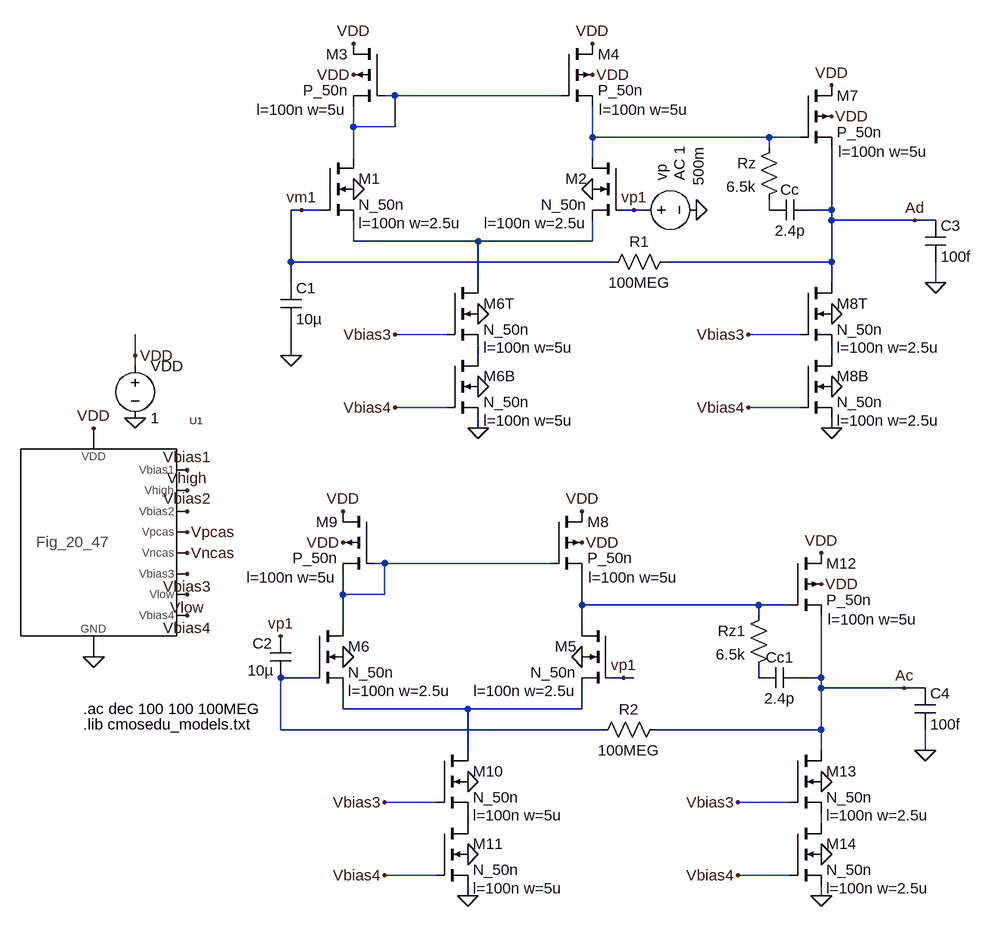
[diagram p0: schematic Fig24_25_CMRR.asc]
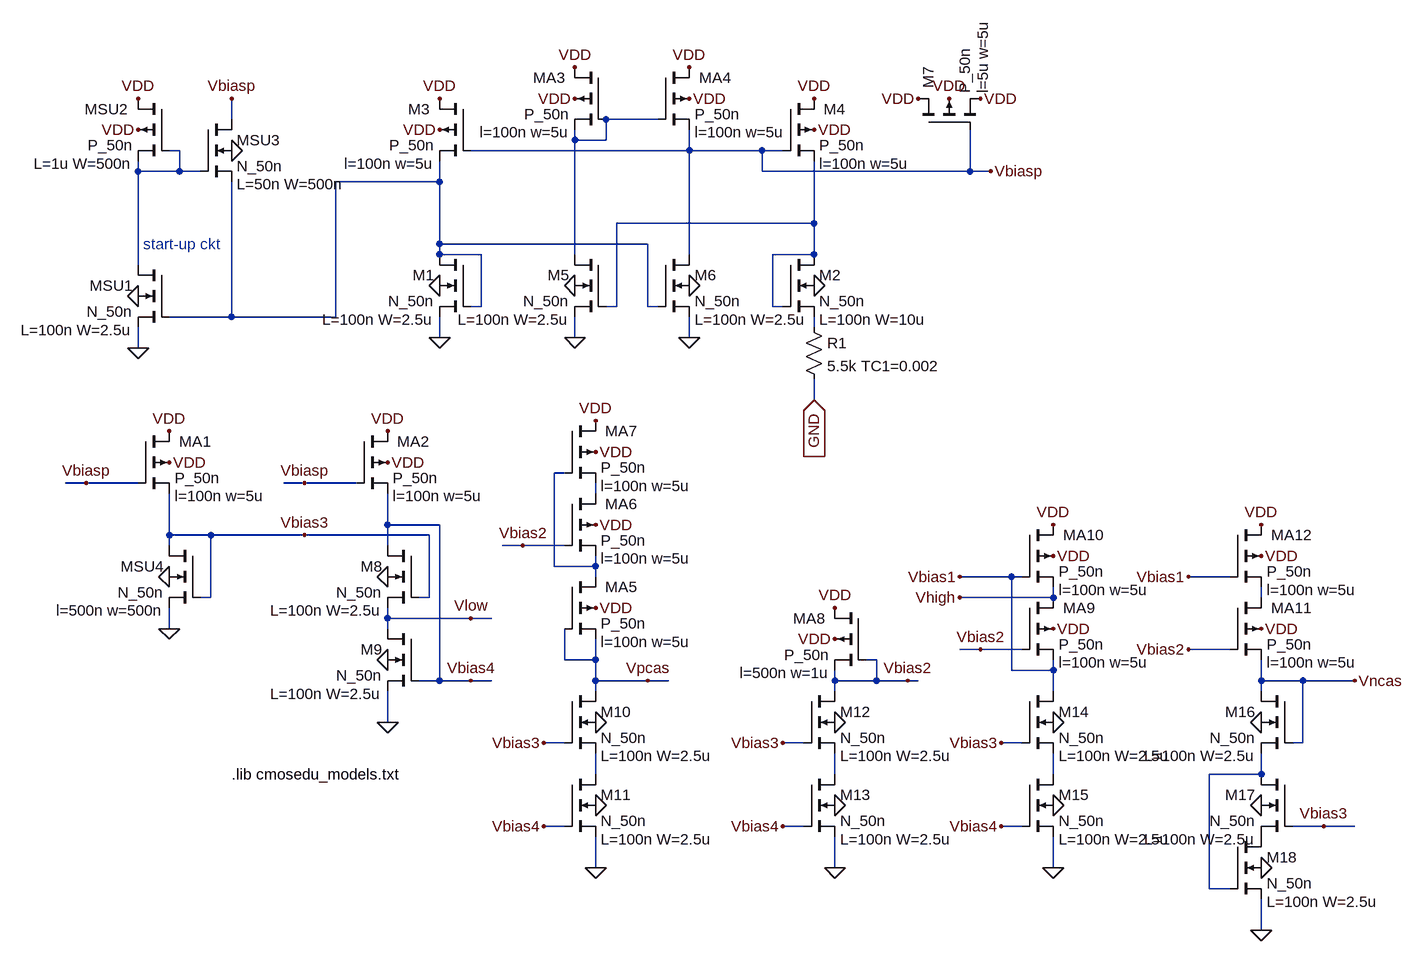
[diagram p1: sub-circuit fig_20_47.asc]
Fig24_25_CMRR.asc, the LTspice schematic file:
Version 4
SHEET 1 2160 680
WIRE 1264 -752 1248 -752
WIRE 1520 -752 1264 -752
WIRE 1200 -704 1200 -736
WIRE 1264 -704 1264 -752
WIRE 1264 -704 1200 -704
WIRE 1568 -688 1568 -736
WIRE 1840 -688 1568 -688
WIRE 1888 -688 1840 -688
WIRE 1840 -672 1840 -688
WIRE 1200 -656 1200 -704
WIRE 1568 -656 1568 -688
WIRE 1120 -576 1104 -576
WIRE 1152 -576 1120 -576
WIRE 1632 -576 1616 -576
WIRE 1648 -576 1632 -576
WIRE 1840 -576 1840 -592
WIRE 1936 -576 1936 -672
WIRE 1936 -576 1904 -576
WIRE 1936 -560 1936 -576
WIRE 2064 -560 1936 -560
WIRE 2096 -560 2064 -560
WIRE 1200 -528 1200 -560
WIRE 1392 -528 1200 -528
WIRE 1568 -528 1568 -560
WIRE 1568 -528 1392 -528
WIRE 1104 -496 1104 -576
WIRE 1600 -496 1104 -496
WIRE 1936 -496 1936 -560
WIRE 1936 -496 1680 -496
WIRE 1104 -464 1104 -496
WIRE 1392 -464 1392 -528
WIRE 1936 -464 1936 -496
WIRE 2096 -464 2096 -496
WIRE 1344 -384 1264 -384
WIRE 1888 -384 1808 -384
WIRE 864 -352 864 -384
WIRE 1104 -352 1104 -400
WIRE 1392 -352 1392 -368
WIRE 1936 -352 1936 -368
WIRE 864 -336 864 -352
WIRE 1344 -272 1264 -272
WIRE 1888 -272 1808 -272
WIRE 1392 -240 1392 -256
WIRE 1936 -240 1936 -256
WIRE 1248 -32 1232 -32
WIRE 1504 -32 1248 -32
WIRE 1184 16 1184 -16
WIRE 1248 16 1248 -32
WIRE 1248 16 1184 16
WIRE 1552 32 1552 -16
WIRE 1824 32 1552 32
WIRE 1872 32 1824 32
WIRE 1824 48 1824 32
WIRE 1184 64 1184 16
WIRE 1552 64 1552 32
WIRE 1136 144 1088 144
WIRE 1616 144 1600 144
WIRE 1632 144 1616 144
WIRE 1824 144 1824 128
WIRE 1920 144 1920 48
WIRE 1920 144 1888 144
WIRE 1920 160 1920 144
WIRE 2048 160 1920 160
WIRE 2080 160 2048 160
WIRE 1184 192 1184 160
WIRE 1376 192 1184 192
WIRE 1552 192 1552 160
WIRE 1552 192 1376 192
WIRE 1088 224 1088 144
WIRE 1584 224 1088 224
WIRE 1920 224 1920 160
WIRE 1920 224 1664 224
WIRE 1376 256 1376 192
WIRE 1920 256 1920 224
WIRE 2080 256 2080 224
WIRE 1328 336 1248 336
WIRE 1872 336 1792 336
WIRE 1376 368 1376 352
WIRE 1920 368 1920 352
WIRE 1328 448 1248 448
WIRE 1872 448 1792 448
WIRE 1376 480 1376 464
WIRE 1920 480 1920 464
FLAG 864 -256 0
FLAG 864 -352 VDD
FLAG 1568 -608 0
FLAG 1392 -240 0
FLAG 1200 -608 0
FLAG 1568 -832 VDD
FLAG 1568 -784 VDD
FLAG 1200 -784 VDD
FLAG 800 -240 VDD
FLAG 800 112 0
FLAG 944 -176 Vbias1
FLAG 944 -144 Vhigh
FLAG 944 -112 Vbias2
FLAG 944 -16 Vbias3
FLAG 944 -80 Vpcas
FLAG 944 -48 Vncas
FLAG 944 48 Vbias4
FLAG 944 16 Vlow
FLAG 1200 -832 VDD
FLAG 1392 -416 0
FLAG 1392 -304 0
FLAG 1264 -384 Vbias3
FLAG 1264 -272 Vbias4
FLAG 1728 -576 0
FLAG 1120 -576 vm1
FLAG 1632 -576 vp1
FLAG 1936 -768 VDD
FLAG 1936 -720 VDD
FLAG 1936 -240 0
FLAG 1936 -416 0
FLAG 1936 -304 0
FLAG 1808 -384 Vbias3
FLAG 1808 -272 Vbias4
FLAG 2064 -560 Ad
FLAG 1104 -352 0
FLAG 2096 -464 0
FLAG 1552 112 0
FLAG 1376 480 0
FLAG 1184 112 0
FLAG 1552 -112 VDD
FLAG 1552 -64 VDD
FLAG 1184 -64 VDD
FLAG 1184 -112 VDD
FLAG 1376 304 0
FLAG 1376 416 0
FLAG 1248 336 Vbias3
FLAG 1248 448 Vbias4
FLAG 1616 144 vp1
FLAG 1920 -48 VDD
FLAG 1920 0 VDD
FLAG 1920 480 0
FLAG 1920 304 0
FLAG 1920 416 0
FLAG 1792 336 Vbias3
FLAG 1792 448 Vbias4
FLAG 2048 160 Ac
FLAG 2080 256 0
FLAG 1088 80 vp1
SYMBOL voltage 864 -352 R0
WINDOW 123 0 0 Left 0
WINDOW 39 0 0 Left 0
SYMATTR InstName VDD
SYMATTR Value 1
SYMBOL nmos4 1616 -656 M0
WINDOW 123 56 100 Left 0
SYMATTR Value2 l=100n w=2.5u
SYMATTR InstName M2
SYMATTR Value N_50n
SYMBOL nmos4 1152 -656 R0
WINDOW 123 56 100 Left 0
SYMATTR Value2 l=100n w=2.5u
SYMATTR InstName M1
SYMATTR Value N_50n
SYMBOL pmos4 1520 -832 R0
WINDOW 123 58 102 Left 0
WINDOW 0 56 16 Left 0
SYMATTR Value2 l=100n w=5u
SYMATTR InstName M4
SYMATTR Value P_50n
SYMBOL pmos4 1248 -832 M0
WINDOW 123 58 102 Left 0
WINDOW 0 56 16 Left 0
SYMATTR Value2 l=100n w=5u
SYMATTR InstName M3
SYMATTR Value P_50n
SYMBOL Fig_20_47 800 -64 R0
SYMATTR InstName U1
SYMBOL nmos4 1344 -464 R0
WINDOW 123 56 100 Left 0
SYMATTR Value2 l=100n w=5u
SYMATTR InstName M6T
SYMATTR Value N_50n
SYMBOL nmos4 1344 -352 R0
WINDOW 123 56 100 Left 0
SYMATTR Value2 l=100n w=5u
SYMATTR InstName M6B
SYMATTR Value N_50n
SYMBOL voltage 1632 -576 R270
WINDOW 0 45 42 Left 0
WINDOW 3 37 99 Left 0
WINDOW 123 45 70 Left 0
WINDOW 39 0 0 Left 0
SYMATTR InstName vp
SYMATTR Value 500m
SYMATTR Value2 AC 1
SYMBOL pmos4 1888 -768 R0
WINDOW 123 58 102 Left 0
WINDOW 0 56 16 Left 0
SYMATTR Value2 l=100n w=5u
SYMATTR InstName M7
SYMATTR Value P_50n
SYMBOL nmos4 1888 -464 R0
WINDOW 123 56 100 Left 0
SYMATTR Value2 l=100n w=2.5u
SYMATTR InstName M8T
SYMATTR Value N_50n
SYMBOL nmos4 1888 -352 R0
WINDOW 123 56 100 Left 0
SYMATTR Value2 l=100n w=2.5u
SYMATTR InstName M8B
SYMATTR Value N_50n
SYMBOL cap 1088 -464 R0
SYMATTR InstName C1
SYMATTR Value 10µ
SYMBOL res 1584 -480 R270
WINDOW 0 32 56 VTop 0
WINDOW 3 0 56 VBottom 0
SYMATTR InstName R1
SYMATTR Value 100MEG
SYMBOL cap 1904 -592 R90
WINDOW 0 0 32 VBottom 0
WINDOW 3 32 32 VTop 0
SYMATTR InstName Cc
SYMATTR Value 2.4p
SYMBOL cap 2080 -560 R0
SYMATTR InstName C3
SYMATTR Value 100f
SYMBOL res 1856 -688 M0
SYMATTR InstName Rz
SYMATTR Value 6.5k
SYMBOL nmos4 1600 64 M0
WINDOW 123 56 100 Left 0
SYMATTR Value2 l=100n w=2.5u
SYMATTR InstName M5
SYMATTR Value N_50n
SYMBOL nmos4 1136 64 R0
WINDOW 123 56 100 Left 0
SYMATTR Value2 l=100n w=2.5u
SYMATTR InstName M6
SYMATTR Value N_50n
SYMBOL pmos4 1504 -112 R0
WINDOW 123 58 102 Left 0
WINDOW 0 56 16 Left 0
SYMATTR Value2 l=100n w=5u
SYMATTR InstName M8
SYMATTR Value P_50n
SYMBOL pmos4 1232 -112 M0
WINDOW 123 58 102 Left 0
WINDOW 0 56 16 Left 0
SYMATTR Value2 l=100n w=5u
SYMATTR InstName M9
SYMATTR Value P_50n
SYMBOL nmos4 1328 256 R0
WINDOW 123 56 100 Left 0
SYMATTR Value2 l=100n w=5u
SYMATTR InstName M10
SYMATTR Value N_50n
SYMBOL nmos4 1328 368 R0
WINDOW 123 56 100 Left 0
SYMATTR Value2 l=100n w=5u
SYMATTR InstName M11
SYMATTR Value N_50n
SYMBOL pmos4 1872 -48 R0
WINDOW 123 58 102 Left 0
WINDOW 0 56 16 Left 0
SYMATTR Value2 l=100n w=5u
SYMATTR InstName M12
SYMATTR Value P_50n
SYMBOL nmos4 1872 256 R0
WINDOW 123 56 100 Left 0
SYMATTR Value2 l=100n w=2.5u
SYMATTR InstName M13
SYMATTR Value N_50n
SYMBOL nmos4 1872 368 R0
WINDOW 123 56 100 Left 0
SYMATTR Value2 l=100n w=2.5u
SYMATTR InstName M14
SYMATTR Value N_50n
SYMBOL res 1568 240 R270
WINDOW 0 32 56 VTop 0
WINDOW 3 0 56 VBottom 0
SYMATTR InstName R2
SYMATTR Value 100MEG
SYMBOL cap 1888 128 R90
WINDOW 0 0 32 VBottom 0
WINDOW 3 32 32 VTop 0
SYMATTR InstName Cc1
SYMATTR Value 2.4p
SYMBOL cap 2064 160 R0
SYMATTR InstName C4
SYMATTR Value 100f
SYMBOL res 1840 32 M0
SYMATTR InstName Rz1
SYMATTR Value 6.5k
SYMBOL cap 1072 80 R0
WINDOW 0 -27 11 Left 0
WINDOW 3 -35 53 Left 0
SYMATTR InstName C2
SYMATTR Value 10µ
TEXT 784 216 Left 0 !.lib cmosedu_models.txt
TEXT 784 192 Left 0 !.ac dec 100 100 100MEG

fig_20_47.asc, the sub-circuit schematic file:
Version 4
SHEET 1 2508 1124
WIRE 464 416 432 416
WIRE 544 -64 544 -80
WIRE 544 80 544 -64
WIRE 544 208 544 176
WIRE 544 416 464 416
WIRE 592 496 592 432
WIRE 592 512 592 496
WIRE 592 640 592 608
WIRE 608 -96 592 -96
WIRE 608 -64 544 -64
WIRE 608 -64 608 -96
WIRE 640 -64 608 -64
WIRE 656 496 592 496
WIRE 656 592 640 592
WIRE 656 592 656 496
WIRE 688 -144 688 -176
WIRE 688 160 592 160
WIRE 688 160 688 -48
WIRE 800 416 768 416
WIRE 800 496 656 496
WIRE 848 160 688 160
WIRE 848 160 848 -48
WIRE 880 416 800 416
WIRE 928 480 928 432
WIRE 928 512 928 480
WIRE 928 624 928 608
WIRE 928 640 928 624
WIRE 928 784 928 736
WIRE 992 496 800 496
WIRE 992 592 976 592
WIRE 992 592 992 496
WIRE 1008 -48 848 -48
WIRE 1008 -48 1008 -80
WIRE 1008 48 1008 -48
WIRE 1008 64 1008 48
WIRE 1008 192 1008 160
WIRE 1008 480 928 480
WIRE 1008 720 976 720
WIRE 1008 720 1008 480
WIRE 1056 624 928 624
WIRE 1056 720 1008 720
WIRE 1072 64 1008 64
WIRE 1072 144 1056 144
WIRE 1072 144 1072 64
WIRE 1088 624 1056 624
WIRE 1088 720 1056 720
WIRE 1136 512 1104 512
WIRE 1184 544 1184 400
WIRE 1200 400 1184 400
WIRE 1200 512 1136 512
WIRE 1200 688 1200 640
WIRE 1200 816 1168 816
WIRE 1200 944 1168 944
WIRE 1216 -112 1216 -128
WIRE 1216 64 1216 -112
WIRE 1216 192 1216 160
WIRE 1248 432 1248 416
WIRE 1248 544 1184 544
WIRE 1248 544 1248 528
WIRE 1248 560 1248 544
WIRE 1248 688 1200 688
WIRE 1248 688 1248 656
WIRE 1248 720 1248 688
WIRE 1248 736 1248 720
WIRE 1248 864 1248 832
WIRE 1248 1008 1248 960
WIRE 1264 -112 1216 -112
WIRE 1264 -112 1264 -144
WIRE 1280 144 1264 144
WIRE 1280 144 1280 16
WIRE 1328 48 1008 48
WIRE 1328 144 1328 48
WIRE 1328 720 1248 720
WIRE 1344 -144 1264 -144
WIRE 1344 144 1328 144
WIRE 1360 720 1328 720
WIRE 1392 -96 1056 -96
WIRE 1392 -96 1392 -128
WIRE 1392 64 1392 -96
WIRE 1392 192 1392 160
WIRE 1504 -96 1392 -96
WIRE 1504 -64 1504 -96
WIRE 1520 144 1520 64
WIRE 1536 -96 1504 -96
WIRE 1536 144 1520 144
WIRE 1568 816 1536 816
WIRE 1568 944 1536 944
WIRE 1584 16 1280 16
WIRE 1584 16 1584 -80
WIRE 1584 64 1520 64
WIRE 1584 64 1584 16
WIRE 1584 176 1584 160
WIRE 1584 288 1584 256
WIRE 1616 720 1616 704
WIRE 1616 736 1616 720
WIRE 1616 864 1616 832
WIRE 1616 1008 1616 960
WIRE 1680 688 1664 688
WIRE 1680 720 1616 720
WIRE 1680 720 1680 688
WIRE 1728 720 1680 720
WIRE 1744 720 1728 720
WIRE 1824 -64 1504 -64
WIRE 1824 -64 1824 -128
WIRE 1840 672 1808 672
WIRE 1856 -64 1824 -64
WIRE 1888 560 1808 560
WIRE 1888 704 1888 560
WIRE 1904 560 1888 560
WIRE 1904 672 1840 672
WIRE 1904 816 1872 816
WIRE 1904 944 1872 944
WIRE 1952 592 1808 592
WIRE 1952 592 1952 576
WIRE 1952 704 1888 704
WIRE 1952 704 1952 688
WIRE 1952 736 1952 704
WIRE 1952 864 1952 832
WIRE 1952 1008 1952 960
WIRE 2192 1040 2192 864
WIRE 2224 560 2160 560
WIRE 2224 672 2160 672
WIRE 2224 1040 2192 1040
WIRE 2272 592 2272 576
WIRE 2272 720 2272 688
WIRE 2272 736 2272 720
WIRE 2272 864 2192 864
WIRE 2272 864 2272 832
WIRE 2272 880 2272 864
WIRE 2272 1104 2272 1056
WIRE 2336 720 2272 720
WIRE 2336 816 2320 816
WIRE 2336 816 2336 720
WIRE 2368 944 2320 944
WIRE 2416 720 2336 720
WIRE 2416 944 2368 944
FLAG 544 -128 VDD
FLAG 544 -176 VDD
FLAG 544 208 0
FLAG 544 128 0
FLAG 688 -96 0
FLAG 688 -176 Vbiasp
FLAG 1008 -128 VDD
FLAG 1008 -176 VDD
FLAG 1584 -128 VDD
FLAG 1584 -176 VDD
FLAG 1856 -64 Vbiasp
FLAG 1008 192 0
FLAG 1008 112 0
FLAG 1584 112 0
FLAG 1392 -176 VDD
FLAG 1392 -224 VDD
FLAG 1216 -176 VDD
FLAG 1216 -224 VDD
FLAG 1216 112 0
FLAG 1392 112 0
FLAG 1216 192 0
FLAG 1392 192 0
FLAG 1792 -176 VDD
FLAG 1744 -176 VDD
FLAG 1840 -176 VDD
FLAG 592 384 VDD
FLAG 592 336 VDD
FLAG 464 416 Vbiasp
FLAG 928 384 VDD
FLAG 928 336 VDD
FLAG 800 416 Vbiasp
FLAG 592 640 0
FLAG 592 560 0
FLAG 928 560 0
FLAG 928 688 0
FLAG 928 784 0
FLAG 800 496 Vbias3
FLAG 1248 784 0
FLAG 1248 912 0
FLAG 1248 1008 0
FLAG 1056 624 Vlow
FLAG 1056 720 Vbias4
FLAG 1168 816 Vbias3
FLAG 1168 944 Vbias4
FLAG 1616 784 0
FLAG 1616 912 0
FLAG 1616 1008 0
FLAG 1536 816 Vbias3
FLAG 1536 944 Vbias4
FLAG 1952 784 0
FLAG 1952 912 0
FLAG 1952 1008 0
FLAG 1872 816 Vbias3
FLAG 1872 944 Vbias4
FLAG 1248 608 VDD
FLAG 1328 720 Vpcas
FLAG 1248 480 VDD
FLAG 1248 368 VDD
FLAG 1248 320 VDD
FLAG 1136 512 Vbias2
FLAG 1616 656 VDD
FLAG 1616 608 VDD
FLAG 1728 720 Vbias2
FLAG 1952 640 VDD
FLAG 1952 528 VDD
FLAG 1952 480 VDD
FLAG 1840 672 Vbias2
FLAG 1808 560 Vbias1
FLAG 1808 592 Vhigh
FLAG 2272 640 VDD
FLAG 2272 528 VDD
FLAG 2272 480 VDD
FLAG 2160 560 Vbias1
FLAG 2160 672 Vbias2
FLAG 2272 784 0
FLAG 2272 912 0
FLAG 2272 1008 0
FLAG 2272 1104 0
FLAG 2416 720 Vncas
FLAG 2368 944 Vbias3
FLAG 1584 288 GND
IOPIN 1584 288 In
SYMBOL pmos4 592 -176 M0
WINDOW 0 63 16 Left 0
WINDOW 123 56 100 Left 0
SYMATTR InstName MSU2
SYMATTR Value2 L=1u W=500n
SYMATTR Value P_50n
SYMBOL nmos4 592 80 M0
WINDOW 123 56 100 Left 0
SYMATTR Value2 L=100n W=2.5u
SYMATTR InstName MSU1
SYMATTR Value N_50n
SYMBOL nmos4 640 -144 R0
WINDOW 123 56 100 Left 0
SYMATTR Value2 L=50n W=500n
SYMATTR InstName MSU3
SYMATTR Value N_50n
SYMBOL pmos4 1056 -176 M0
WINDOW 0 63 16 Left 0
WINDOW 123 56 100 Left 0
SYMATTR InstName M3
SYMATTR Value2 l=100n w=5u
SYMATTR Value P_50n
SYMBOL pmos4 1536 -176 R0
WINDOW 0 63 16 Left 0
WINDOW 123 56 100 Left 0
SYMATTR InstName M4
SYMATTR Value2 l=100n w=5u
SYMATTR Value P_50n
SYMBOL nmos4 1056 64 M0
WINDOW 123 56 100 Left 0
SYMATTR Value2 L=100n W=2.5u
SYMATTR InstName M1
SYMATTR Value N_50n
SYMBOL nmos4 1536 64 R0
WINDOW 123 56 100 Left 0
SYMATTR Value2 L=100n W=10u
SYMATTR InstName M2
SYMATTR Value N_50n
SYMBOL res 1568 160 R0
SYMATTR InstName R1
SYMATTR Value 5.5k TC1=0.002
SYMBOL pmos4 1344 -224 R0
WINDOW 0 63 16 Left 0
WINDOW 123 56 100 Left 0
SYMATTR InstName MA4
SYMATTR Value2 l=100n w=5u
SYMATTR Value P_50n
SYMBOL pmos4 1264 -224 M0
WINDOW 0 63 16 Left 0
WINDOW 123 56 100 Left 0
SYMATTR InstName MA3
SYMATTR Value2 l=100n w=5u
SYMATTR Value P_50n
SYMBOL nmos4 1264 64 M0
WINDOW 123 56 100 Left 0
SYMATTR Value2 L=100n W=2.5u
SYMATTR InstName M5
SYMATTR Value N_50n
SYMBOL nmos4 1344 64 R0
WINDOW 123 56 100 Left 0
SYMATTR Value2 L=100n W=2.5u
SYMATTR InstName M6
SYMATTR Value N_50n
SYMBOL pmos4 1744 -128 R270
WINDOW 0 63 16 Left 0
WINDOW 123 56 100 Left 0
SYMATTR InstName M7
SYMATTR Value2 l=5u w=5u
SYMATTR Value P_50n
SYMBOL pmos4 544 336 R0
WINDOW 0 63 16 Left 0
WINDOW 123 56 100 Left 0
SYMATTR InstName MA1
SYMATTR Value2 l=100n w=5u
SYMATTR Value P_50n
SYMBOL pmos4 880 336 R0
WINDOW 0 63 16 Left 0
WINDOW 123 56 100 Left 0
SYMATTR InstName MA2
SYMATTR Value2 l=100n w=5u
SYMATTR Value P_50n
SYMBOL nmos4 640 512 M0
WINDOW 123 56 100 Left 0
SYMATTR Value2 l=500n w=500n
SYMATTR InstName MSU4
SYMATTR Value N_50n
SYMBOL nmos4 976 512 M0
WINDOW 123 56 100 Left 0
SYMATTR Value2 L=100n W=2.5u
SYMATTR InstName M8
SYMATTR Value N_50n
SYMBOL nmos4 976 640 M0
WINDOW 123 56 100 Left 0
SYMATTR Value2 L=100n W=2.5u
SYMATTR InstName M9
SYMATTR Value N_50n
SYMBOL nmos4 1200 736 R0
WINDOW 123 56 100 Left 0
SYMATTR Value2 L=100n W=2.5u
SYMATTR InstName M10
SYMATTR Value N_50n
SYMBOL nmos4 1200 864 R0
WINDOW 123 56 100 Left 0
SYMATTR Value2 L=100n W=2.5u
SYMATTR InstName M11
SYMATTR Value N_50n
SYMBOL nmos4 1568 736 R0
WINDOW 123 56 100 Left 0
SYMATTR Value2 L=100n W=2.5u
SYMATTR InstName M12
SYMATTR Value N_50n
SYMBOL nmos4 1568 864 R0
WINDOW 123 56 100 Left 0
SYMATTR Value2 L=100n W=2.5u
SYMATTR InstName M13
SYMATTR Value N_50n
SYMBOL nmos4 1904 736 R0
WINDOW 123 56 100 Left 0
SYMATTR Value2 L=100n W=2.5u
SYMATTR InstName M14
SYMATTR Value N_50n
SYMBOL nmos4 1904 864 R0
WINDOW 123 56 100 Left 0
SYMATTR Value2 L=100n W=2.5u
SYMATTR InstName M15
SYMATTR Value N_50n
SYMBOL pmos4 1200 560 R0
WINDOW 0 63 16 Left 0
WINDOW 123 56 100 Left 0
SYMATTR InstName MA5
SYMATTR Value2 l=100n w=5u
SYMATTR Value P_50n
SYMBOL pmos4 1200 432 R0
WINDOW 0 63 16 Left 0
WINDOW 123 56 100 Left 0
SYMATTR InstName MA6
SYMATTR Value2 l=100n w=5u
SYMATTR Value P_50n
SYMBOL pmos4 1200 320 R0
WINDOW 0 63 16 Left 0
WINDOW 123 56 100 Left 0
SYMATTR InstName MA7
SYMATTR Value2 l=100n w=5u
SYMATTR Value P_50n
SYMBOL pmos4 1664 608 M0
WINDOW 0 63 16 Left 0
WINDOW 123 56 100 Left 0
SYMATTR InstName MA8
SYMATTR Value2 l=500n w=1u
SYMATTR Value P_50n
SYMBOL pmos4 1904 592 R0
WINDOW 0 63 16 Left 0
WINDOW 123 56 100 Left 0
SYMATTR InstName MA9
SYMATTR Value2 l=100n w=5u
SYMATTR Value P_50n
SYMBOL pmos4 1904 480 R0
WINDOW 0 63 16 Left 0
WINDOW 123 56 100 Left 0
SYMATTR InstName MA10
SYMATTR Value2 l=100n w=5u
SYMATTR Value P_50n
SYMBOL pmos4 2224 592 R0
WINDOW 0 63 16 Left 0
WINDOW 123 56 100 Left 0
SYMATTR InstName MA11
SYMATTR Value2 l=100n w=5u
SYMATTR Value P_50n
SYMBOL pmos4 2224 480 R0
WINDOW 0 63 16 Left 0
WINDOW 123 56 100 Left 0
SYMATTR InstName MA12
SYMATTR Value2 l=100n w=5u
SYMATTR Value P_50n
SYMBOL nmos4 2320 736 M0
WINDOW 123 56 100 Left 0
SYMATTR Value2 L=100n W=2.5u
SYMATTR InstName M16
SYMATTR Value N_50n
SYMBOL nmos4 2320 864 M0
WINDOW 123 56 100 Left 0
SYMATTR Value2 L=100n W=2.5u
SYMATTR InstName M17
SYMATTR Value N_50n
SYMBOL nmos4 2224 960 R0
WINDOW 123 56 100 Left 0
SYMATTR Value2 L=100n W=2.5u
SYMATTR InstName M18
SYMATTR Value N_50n
TEXT 552 48 Left 0 ;start-up ckt
TEXT 688 864 Left 0 !.lib cmosedu_models.txt

The netlist it stands for:
* Fig24_25_CMRR.asc
VDD VDD 0 1
M2 N002 vp1 N004 0 N_50n l=100n w=2.5u
M1 N001 vm1 N004 0 N_50n l=100n w=2.5u
M4 VDD N001 N002 VDD P_50n l=100n w=5u
M3 VDD N001 N001 VDD P_50n l=100n w=5u
XU1 Vbias1 Vhigh Vbias2 Vpcas Vncas Vbias3 Vlow Vbias4 VDD 0 fig_20_47
M6T N004 Vbias3 N005 0 N_50n l=100n w=5u
M6B N005 Vbias4 0 0 N_50n l=100n w=5u
vp vp1 0 500m AC 1
M7 VDD N002 Ad VDD P_50n l=100n w=5u
M8T Ad Vbias3 N006 0 N_50n l=100n w=2.5u
M8B N006 Vbias4 0 0 N_50n l=100n w=2.5u
C1 vm1 0 10µ
R1 vm1 Ad 100MEG
Cc Ad N003 2.4p
C3 Ad 0 100f
Rz N002 N003 6.5k
M5 N008 vp1 N011 0 N_50n l=100n w=2.5u
M6 N007 N009 N011 0 N_50n l=100n w=2.5u
M8 VDD N007 N008 VDD P_50n l=100n w=5u
M9 VDD N007 N007 VDD P_50n l=100n w=5u
M10 N011 Vbias3 N012 0 N_50n l=100n w=5u
M11 N012 Vbias4 0 0 N_50n l=100n w=5u
M12 VDD N008 Ac VDD P_50n l=100n w=5u
M13 Ac Vbias3 N013 0 N_50n l=100n w=2.5u
M14 N013 Vbias4 0 0 N_50n l=100n w=2.5u
R2 N009 Ac 100MEG
Cc1 Ac N010 2.4p
C4 Ac 0 100f
Rz1 N008 N010 6.5k
C2 vp1 N009 10µ

* block symbol definitions
.subckt fig_20_47 Vbias1 Vhigh Vbias2 Vpcas Vncas Vbias3 Vlow Vbias4 VDD GND
MSU2 VDD N001 N001 VDD P_50n L=1u W=500n
MSU1 N001 N002 0 0 N_50n L=100n W=2.5u
MSU3 Vbiasp N001 N002 0 N_50n L=50n W=500n
M3 VDD Vbiasp N002 VDD P_50n l=100n w=5u
M4 VDD Vbiasp N007 VDD P_50n l=100n w=5u
M1 N002 N002 0 0 N_50n L=100n W=2.5u
M2 N007 N007 N008 0 N_50n L=100n W=10u
R1 N008 GND 5.5k TC1=0.002
MA4 VDD N004 Vbiasp VDD P_50n l=100n w=5u
MA3 VDD N004 N004 VDD P_50n l=100n w=5u
M5 N004 N007 0 0 N_50n L=100n W=2.5u
M6 Vbiasp N002 0 0 N_50n L=100n W=2.5u
M7 VDD Vbiasp VDD VDD P_50n l=5u w=5u
MA1 VDD Vbiasp Vbias3 VDD P_50n l=100n w=5u
MA2 VDD Vbiasp Vbias4 VDD P_50n l=100n w=5u
MSU4 Vbias3 Vbias3 0 0 N_50n l=500n w=500n
M8 Vbias4 Vbias3 Vlow 0 N_50n L=100n W=2.5u
M9 Vlow Vbias4 0 0 N_50n L=100n W=2.5u
M10 Vpcas Vbias3 N006 0 N_50n L=100n W=2.5u
M11 N006 Vbias4 0 0 N_50n L=100n W=2.5u
M12 Vbias2 Vbias3 N009 0 N_50n L=100n W=2.5u
M13 N009 Vbias4 0 0 N_50n L=100n W=2.5u
M14 Vbias1 Vbias3 N010 0 N_50n L=100n W=2.5u
M15 N010 Vbias4 0 0 N_50n L=100n W=2.5u
MA5 N003 Vpcas Vpcas VDD P_50n l=100n w=5u
MA6 N005 Vbias2 N003 VDD P_50n l=100n w=5u
MA7 VDD N003 N005 VDD P_50n l=100n w=5u
MA8 VDD Vbias2 Vbias2 VDD P_50n l=500n w=1u
MA9 Vhigh Vbias2 Vbias1 VDD P_50n l=100n w=5u
MA10 VDD Vbias1 Vhigh VDD P_50n l=100n w=5u
MA11 N012 Vbias2 Vncas VDD P_50n l=100n w=5u
MA12 VDD Vbias1 N012 VDD P_50n l=100n w=5u
M16 Vncas Vncas N011 0 N_50n L=100n W=2.5u
M17 N011 Vbias3 P001 0 N_50n L=100n W=2.5u
M18 P001 N011 0 0 N_50n L=100n W=2.5u
* start-up ckt
.lib cmosedu_models.txt
.ends fig_20_47

.model NMOS NMOS
.model PMOS PMOS
.lib standard.mos
.lib cmosedu_models.txt
.ac dec 100 100 100MEG
.backanno
.end